# Altium project EV75E52A_R3.PrjPcb (part 1 of 4)
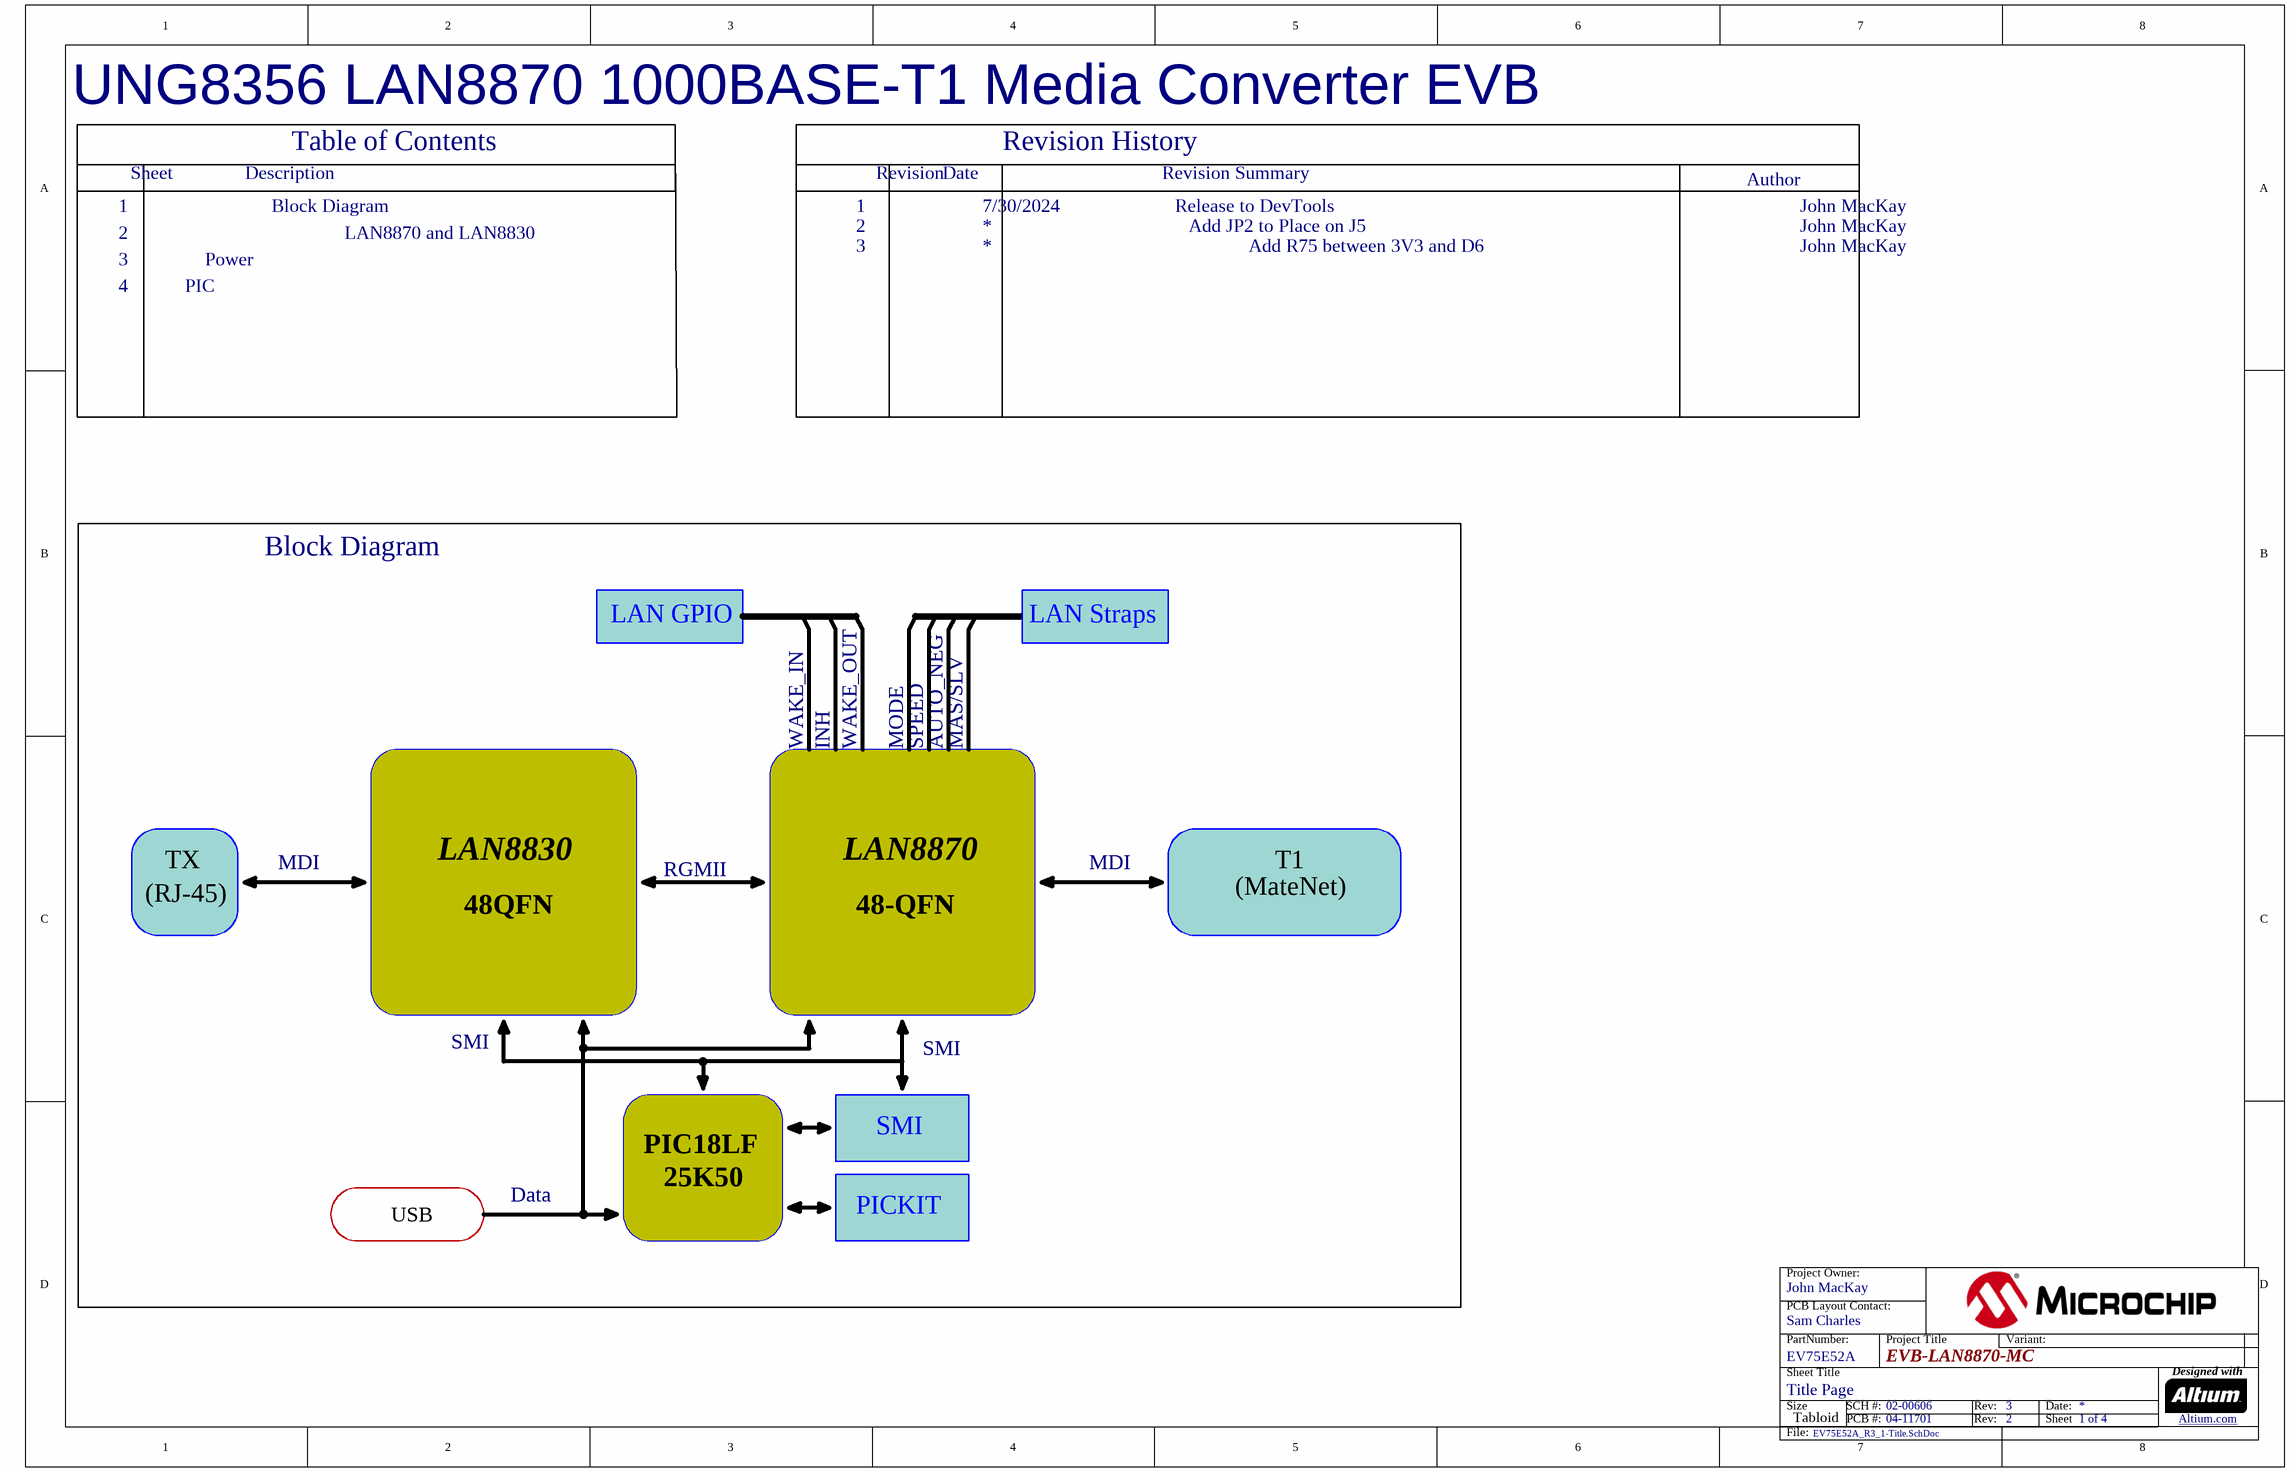
[diagram p0: EV75E52A_R3_1-Title.SchDoc]
SheetTotal: 4; Sheet4Title: PIC; Sheet3Title: Power; Sheet2Title: LAN8870 and LAN8830; Sheet1Title: Block Diagram; ProjectTitle: EVB-LAN8870-MC; ProjectPCBFabRevision: 2; ProjectPCBFabNumber: 04-11701; ProjectPCBAssyRevision: 3; ProjectPCBAssyNumber: 02-00606; ProjectPartNumber: EV75E52A; ProjectContactPCB: Sam Charles; ProjectContactOwner: John MacKay; ProjectBoardNumber: 11701
4 sheets, 207 parts. Net scope: global (net labels, ports and power ports of the same name join across sheets).
Board file: EV75E52A_R2.PcbDoc
Sheets:
  EV75E52A_R3_1-Title.SchDoc
  EV75E52A_R3_2-PHYs.SchDoc
  EV75E52A_R3_3-Power.SchDoc
  EV75E52A_R3_4-PIC_USB.SchDoc

## Sheet EV75E52A_R3_1-Title.SchDoc
size Tabloid; DocumentNumber: 1; SheetNumber: 1; SheetTotal: 4; PageSetup: Record=PageOptions|CenterHorizontal=True|CenterVertical=True|PrintScale=1.02|XCorrection=1.00|YCorrection=1.00|PrintKind=0|BorderSize=5000000|LeftOffset=0|BottomOffset=0|Orientation=2|PaperLength=1000|PaperWidth=1000|Scale=100|PaperSource=15|PrintQuality=600|MediaType=1|DitherType=10|PrintScaleMode=1|PaperKind=11x17|PaperIndex=17; PageTitle: Title Page; SheetTitle: Title Page; DocumentFullPathAndName: //depot_np_hweng_boards/ung_hweng/UNG_8017_EVB-USB5926/; ProjectName: EV75E52A_R3.PrjPcb

### Notes on the sheet
- UNG8356 LAN8870 1000BASE-T1 Media Converter EVB
- Table of Contents
- Revision History
- 1
- Sheet
- Description
- Revision
- Date
- 7/30/2024
- Revision Summary
- Release to DevTools
- Author
- John MacKay
- 2
- 3
- 4
- PIC
- Add JP2 to Place on J5
- Add R75 between 3V3 and D6
- Block Diagram
- LAN GPIO
- LAN Straps
- WAKE_IN
- INH
- WAKE_OUT
- MODE
- SPEED
- AUTO_NEG
- MAS/SLV
- TX
- MDI
- LAN8830
- RGMII
- LAN8870
- T1
- (RJ-45)
- 48QFN
- 48-QFN
- (MateNet)
- SMI
- PIC18LF
- USB
- Data
- 25K50
- PICKIT
- Project Owner:
- PCB Layout Contact:
- PartNumber:
- Project Title
- Variant:
- Sheet Title
- Size
- Tabloid
- SCH #:
- PCB #:
- Rev:
- Date:
- Designed with
- Altium.com <http://go.altium.com/MicrochipLandingPage_Evaluation.html>
- File:

## Sheet EV75E52A_R3_2-PHYs.SchDoc: LAN8870 and KSZ9131
size Tabloid; DocumentNumber: 2; SheetNumber: 2; SheetTotal: 4; PageSetup: Record=PageOptions|CenterHorizontal=True|CenterVertical=True|PrintScale=1.02|XCorrection=1.00|YCorrection=1.00|PrintKind=0|BorderSize=5000000|LeftOffset=0|BottomOffset=0|Orientation=2|PaperLength=1000|PaperWidth=1000|Scale=100|PaperSource=15|PrintQuality=-3|MediaType=1|DitherType=10|PrintScaleMode=1|PaperKind=11 x 17|PaperIndex=119; PageTitle: LAN8870 and LAN8830; PartNumber: LAN8870_MC; SheetTitle: LAN8870 and LAN8830; DocumentFullPathAndName: //depot_np_hweng_boards/ung_hweng/UNG_8017_EVB-USB5926/
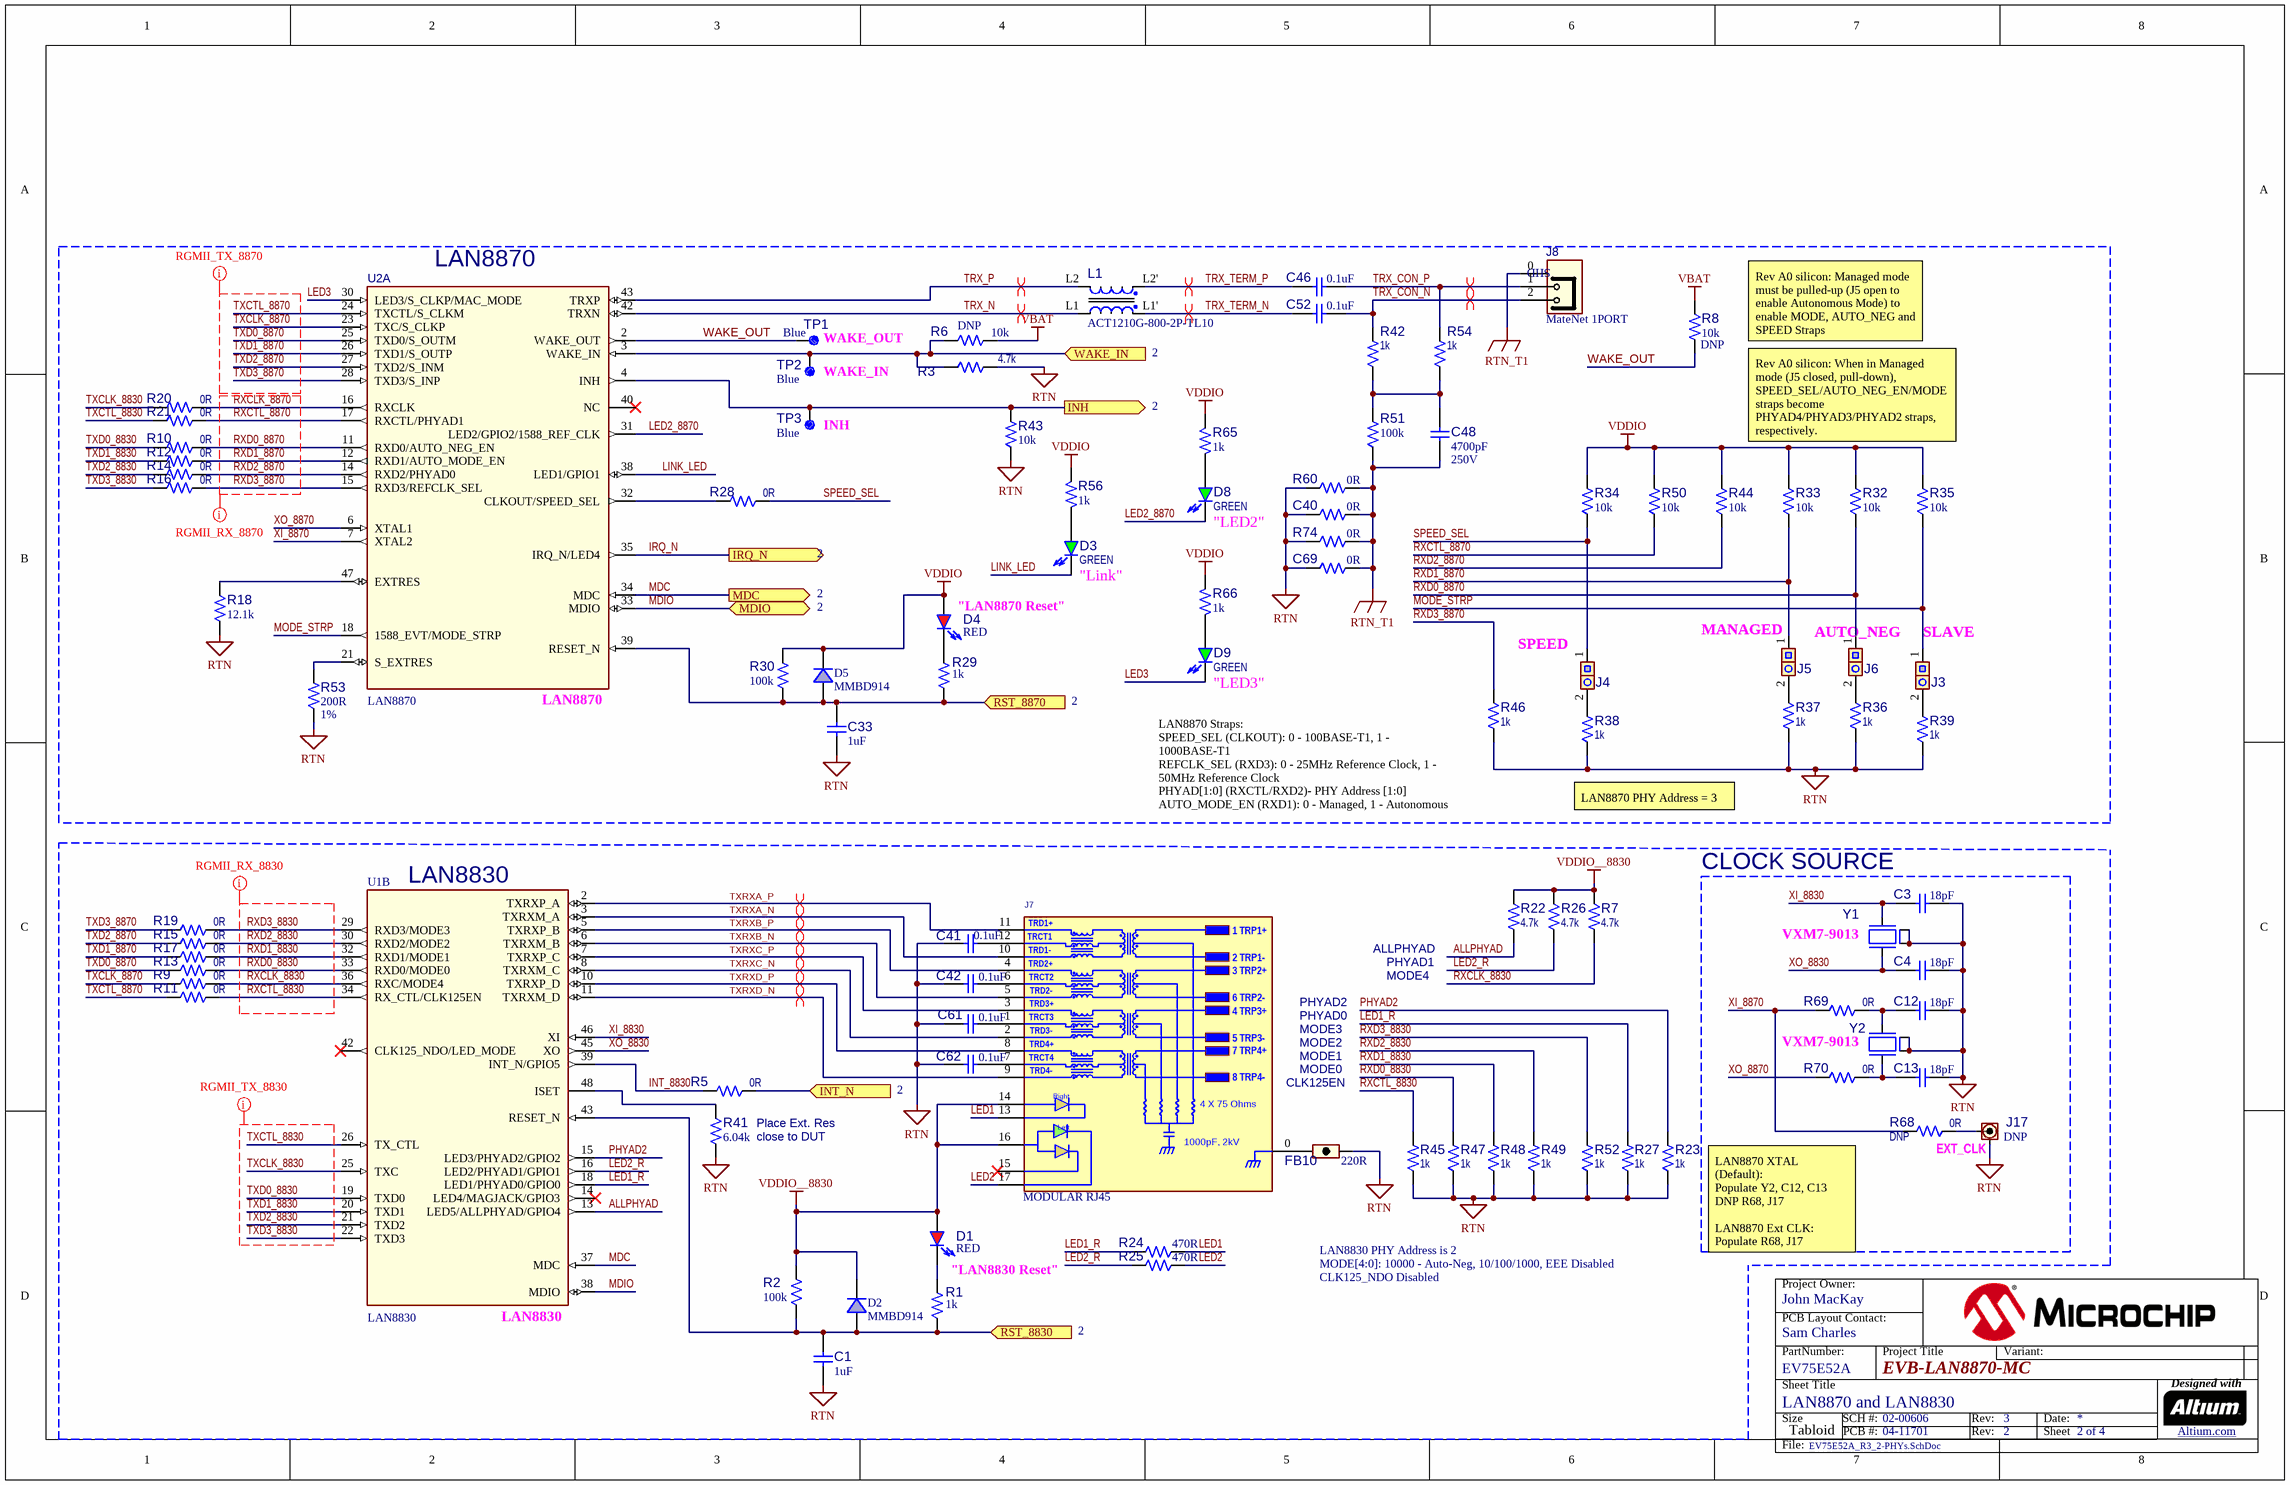
[diagram p1: EV75E52A_R3_2-PHYs.SchDoc]

### Parts
C1  1uF  [CAP_C_0603]
C3  value 18pF  [CAP_C_0402]  (hidden comment: Capacitor NP)
C4  value 18pF  [CAP_C_0402]  (hidden comment: Capacitor NP)
C12  value 18pF  [CAP_C_0402]  (hidden comment: Capacitor NP)
C13  value 18pF  [CAP_C_0402]  (hidden comment: Capacitor NP)
C33  1uF  [CAP_C_0603]
C40  value 0R  [RES_C_0603]  (hidden comment: Resistor)
C41  value 0.1uF  [CAP_C_0402]  (hidden comment: Capacitor NP)
C42  value 0.1uF  [CAP_C_0402]  (hidden comment: Capacitor NP)
C46  value 0.1uF  [CAP_C_0805]  (hidden comment: Capacitor NP)
C48  value 4700pF  Voltage: 250V  [CAP_C_0805]  (hidden comment: Capacitor NP)
C52  value 0.1uF  [CAP_C_0805]  (hidden comment: Capacitor NP)
C61  value 0.1uF  [CAP_C_0402]  (hidden comment: Capacitor NP)
C62  value 0.1uF  [CAP_C_0402]  (hidden comment: Capacitor NP)
C69  value 0R  [RES_C_0603]  (hidden comment: Resistor)
D1  value RED  Legend Note: "LAN8830 Reset"  [LED_0603_RED]  (hidden comment: LED_red)
D2  MMBD914  [SOT-23-3]
D3  value GREEN  Legend Notes: "Link"  [LED_0603_GREEN]  (hidden comment: LED_green)
D4  value RED  Legend Note: "LAN8870 Reset"  [LED_0603_RED]  (hidden comment: LED_red)
D5  MMBD914  [SOT-23-3]
D8  value GREEN  Legend Notes: "LED2"  [LED_0603_GREEN]  (hidden comment: LED_green)
D9  value GREEN  Legend Notes: "LED3"  [LED_0603_GREEN]  (hidden comment: LED_green)
FB10  value 220R  [IND_C_0603]  (hidden comment: Ferrite Bead)
J3  Legend Notes: SLAVE  [HDR_M_2.54_1x2]  (hidden comment: Header 1x2)
J4  Legend Notes: SPEED  [HDR_M_2.54_1x2]  (hidden comment: Header 1x2)
J5  Legend Notes: MANAGED  [HDR_M_2.54_1x2]  (hidden comment: Header 1x2)
J6  Legend Notes: AUTO_NEG  [HDR_M_2.54_1x2]  (hidden comment: Header 1x2)
J7  value MODULAR RJ45  [CON_JACK_RJ45_L829-1J1T-43]  (hidden comment: CON_RJ-45_L829-1J1T-43)
J8  value MateNet 1PORT  [CON_2304372-9]  (hidden comment: 3PIN_WSHD)
J17  Populated: DNP  Legend Note: EXT_CLK  [CON_MMCX_CINCH_135-3701-211]  (hidden comment: RF MMCX Female)
L1  Manufacturer Part Number 1: ACT1210G-800-2P-TL10  [IND_TDK_ACT1210L-201-2P_L3.9W2.5H2.5]  (hidden comment: Inductor Choke)
R1  1k  [RES_C_0603]
R2  100k  [RES_C_0603]
R3  value 4.7k  [RES_C_0402]  (hidden comment: Resistor)
R5  value 0R  [RES_C_0402]  (hidden comment: Resistor)
R6  value 10k  Populated: DNP  [RES_C_0402]  (hidden comment: Resistor)
R7  value 4.7k  [RES_C_0402]  (hidden comment: Resistor)
R8  value 10k  Populated: DNP  [RES_C_0402]  (hidden comment: Resistor)
R9  value 0R  [RES_C_0402]  (hidden comment: Resistor)
R10  value 0R  [RES_C_0402]  (hidden comment: Resistor)
R11  value 0R  [RES_C_0402]  (hidden comment: Resistor)
R12  value 0R  [RES_C_0402]  (hidden comment: Resistor)
R13  value 0R  [RES_C_0402]  (hidden comment: Resistor)
R14  value 0R  [RES_C_0402]  (hidden comment: Resistor)
R15  value 0R  [RES_C_0402]  (hidden comment: Resistor)
R16  value 0R  [RES_C_0402]  (hidden comment: Resistor)
R17  value 0R  [RES_C_0402]  (hidden comment: Resistor)
R18  value 12.1k  [RES_C_0402]  (hidden comment: Resistor)
R19  value 0R  [RES_C_0402]  (hidden comment: Resistor)
R20  value 0R  [RES_C_0402]  (hidden comment: Resistor)
R21  value 0R  [RES_C_0402]  (hidden comment: Resistor)
R22  value 4.7k  [RES_C_0402]  (hidden comment: Resistor)
R23  value 1k  [RES_C_0402]  (hidden comment: Resistor)
R24  value 470R  [RES_C_0402]  (hidden comment: Resistor)
R25  value 470R  [RES_C_0402]  (hidden comment: Resistor)
R26  value 4.7k  [RES_C_0402]  (hidden comment: Resistor)
R27  value 1k  [RES_C_0402]  (hidden comment: Resistor)
R28  value 0R  [RES_C_0402]  (hidden comment: Resistor)
R29  1k  [RES_C_0603]
R30  100k  [RES_C_0603]
R32  value 10k  [RES_C_0402]  (hidden comment: Resistor)
R33  value 10k  [RES_C_0402]  (hidden comment: Resistor)
R34  value 10k  [RES_C_0402]  (hidden comment: Resistor)
R35  value 10k  [RES_C_0402]  (hidden comment: Resistor)
R36  value 1k  [RES_C_0402]  (hidden comment: Resistor)
R37  value 1k  [RES_C_0402]  (hidden comment: Resistor)
R38  value 1k  [RES_C_0402]  (hidden comment: Resistor)
R39  value 1k  [RES_C_0402]  (hidden comment: Resistor)
R41  value 6.04k  [RES_C_0402]  (hidden comment: Resistor)
R42  value 1k  [RES_C_1206]  (hidden comment: Resistor)
R43  value 10k  [RES_C_0402]  (hidden comment: Resistor)
R44  value 10k  [RES_C_0402]  (hidden comment: Resistor)
R45  value 1k  [RES_C_0402]  (hidden comment: Resistor)
R46  value 1k  [RES_C_0402]  (hidden comment: Resistor)
R47  value 1k  [RES_C_0402]  (hidden comment: Resistor)
R48  value 1k  [RES_C_0402]  (hidden comment: Resistor)
R49  value 1k  [RES_C_0402]  (hidden comment: Resistor)
R50  value 10k  [RES_C_0402]  (hidden comment: Resistor)
R51  value 100k  [RES_C_0603]  (hidden comment: Resistor)
R52  value 1k  [RES_C_0402]  (hidden comment: Resistor)
R53  value 200R  Tolerance: 1%  [RES_C_0402]  (hidden comment: Resistor)
R54  value 1k  [RES_C_1206]  (hidden comment: Resistor)
R56  value 1k  [RES_C_0603]  (hidden comment: Resistor)
R60  value 0R  [RES_C_0603]  (hidden comment: Resistor)
R65  value 1k  [RES_C_0603]  (hidden comment: Resistor)
R66  value 1k  [RES_C_0603]  (hidden comment: Resistor)
R68  value 0R  Populated: DNP  [RES_C_0402]  (hidden comment: Resistor)
R69  value 0R  [RES_C_0402]  (hidden comment: Resistor)
R70  value 0R  [RES_C_0402]  (hidden comment: Resistor)
R74  value 0R  [RES_C_0603]  (hidden comment: Resistor)
TP1  value Blue  Legend Note: WAKE_OUT  [CON_TP_TH_V_BLUE_KEC_5117]  (hidden comment: Test Point)
TP2  value Blue  Legend Note: WAKE_IN  [CON_TP_TH_V_BLUE_KEC_5117]  (hidden comment: Test Point)
TP3  value Blue  Legend Note: INH  [CON_TP_TH_V_BLUE_KEC_5117]  (hidden comment: Test Point)
U1  value LAN8830  [QFN-48_7x7_EP5.15x5.15]  (hidden comment: LAN8830 QFN-48)  (part B of 2)
U2  value LAN8870  [QFN-48_7x7_EP5.1x5.1]  (hidden comment: LAN8870 QFN-48)  (part A of 2)
Y1  Legend Note: VXM7-9013  [CRYSTAL_L3.2W2.5H0.8]  (hidden comment: Crystal 4 Pins)
Y2  Crystal 4 Pins  [CRYSTAL_L3.2W2.5H0.8]  (value not drawn)

### Blocks framed on the sheet
LAN8870: C33 C40 C46 C48 C52 C69 D3-D5 D8 D9 J3-J6 J8 L1 R3 R6 R8 R10 R12 R14 R16 R18 R20 R21 R28-R30 R32-R39 R42-R44 R46 R50 R51 R53 R54 R56 R60 R65 R66 R74 TP1-TP3 U2
LAN8830: C1 C41 C42 C61 C62 D1 D2 FB10 J7 R1 R2 R5 R7 R9 R11 R13 R15 R17 R19 R22-R27 R41 R45 R47-R49 R52 U1
CLOCK SOURCE: C3 C4 C12 C13 J17 R68-R70 Y1 Y2

### Ports
INH (out), INT_N (in), IRQ_N (out), MDC (out), MDIO (bidir), RST_8830 (in), RST_8870 (in), WAKE_IN (in)

### Nets
RTN: C1.1 C3.2 C4.2 C12.2 C13.2 C33.1 C40.1 C41.1 C42.1 C61.1 C62.1 C69.1 FB10.2 J17.2 R3.1 R18.1 R23.1 R27.1 R36.1 R37.1 R38.1 R39.1 R41.1 R43.1 R45.1 R46.1 R47.1 R48.1 R49.1 R52.1 R53.1 R60.1 R74.1 Y1.2(GND) Y1.4(GND) Y2.2(GND) Y2.4(GND)
RTN_T1: C40.2 C48.1 C69.2 J8.0 R51.1 R60.2 R74.2
VBAT: R6.1 R8.2
VDDIO: D4.1(A) D5.3(K) R30.2 R32.2 R33.2 R34.2 R35.2 R44.2 R50.2 R56.1 R65.1 R66.1
VDDIO__8830: D1.1(A) D2.3(K) J7.14 J7.16 R2.2 R7.2 R22.2 R26.2
ALLPHYAD: R22.1 U1.13(LED5/ALLPHYAD/GPIO4)
INH: R43.2 TP3.1 U2.4(INH) ; port INH
INT_8830: R5.1 U1.39(INT_N/GPIO5)
INT_N: R5.2 ; port INT_N
IRQ_N: U2.35(IRQ_N/LED4) ; port IRQ_N
LED1: J7.13 R24.2
LED1_R: R24.1 R27.2 U1.18(LED1/PHYAD0/GPIO0)
LED2: J7.17 R25.2
LED2_8870: D8.2(K) U2.31(LED2/GPIO2/1588_REF_CLK)
LED2_R: R25.1 R26.1 U1.16(LED2/PHYAD1/GPIO1)
LED3: D9.2(K) U2.30(LED3/S_CLKP/MAC_MODE)
LINK_LED: D3.2(K) U2.38(LED1/GPIO1)
MDC: U1.37(MDC) U2.34(MDC) ; port MDC
MDIO: U1.38(MDIO) U2.33(MDIO) ; port MDIO
MODE_STRP: J3.1 R35.1 U2.18(1588_EVT/MODE_STRP)
PHYAD2: R23.2 U1.15(LED3/PHYAD2/GPIO2)
RST_8830: C1.2 D2.1(A) R1.2 R2.1 U1.43(RESET_N) ; port RST_8830
RST_8870: C33.2 D5.1(A) R29.2 R30.1 U2.39(RESET_N) ; port RST_8870
RXCLK_8830: R7.1 R9.2 U1.36(RXC/MODE4)
RXCLK_8870: R20.2 U2.16(RXCLK)
RXCTL_8830: R11.2 R45.2 U1.34(RX_CTL/CLK125EN)
RXCTL_8870: R21.2 R50.1 U2.17(RXCTL/PHYAD1)
RXD0_8830: R13.2 R47.2 U1.33(RXD0/MODE0)
RXD0_8870: J6.1 R10.2 R32.1 U2.11(RXD0/AUTO_NEG_EN)
RXD1_8830: R17.2 R48.2 U1.32(RXD1/MODE1)
RXD1_8870: J5.1 R12.2 R33.1 U2.12(RXD1/AUTO_MODE_EN)
RXD2_8830: R15.2 R49.2 U1.30(RXD2/MODE2)
RXD2_8870: R14.2 R44.1 U2.14(RXD2/PHYAD0)
RXD3_8830: R19.2 R52.2 U1.29(RXD3/MODE3)
RXD3_8870: R16.2 R46.2 U2.15(RXD3/REFCLK_SEL)
SPEED_SEL: J4.1 R28.2 R34.1
TRX_CON_N: C52.1 J8.2 R42.2
TRX_CON_P: C46.1 J8.1 R54.2
TRX_N: L1.L1 U2.42(TRXN)
TRX_P: L1.L2 U2.43(TRXP)
TRX_TERM_N: C52.2 L1.L1'
TRX_TERM_P: C46.2 L1.L2'
TXCLK_8830: R20.1 U1.25(TXC)
TXCLK_8870: R9.1 U2.23(TXC/S_CLKP)
TXCTL_8830: R21.1 U1.26(TX_CTL)
TXCTL_8870: R11.1 U2.24(TXCTL/S_CLKM)
TXD0_8830: R10.1 U1.19(TXD0)
TXD0_8870: R13.1 U2.25(TXD0/S_OUTM)
TXD1_8830: R12.1 U1.20(TXD1)
TXD1_8870: R17.1 U2.26(TXD1/S_OUTP)
TXD2_8830: R14.1 U1.21(TXD2)
TXD2_8870: R15.1 U2.27(TXD2/S_INM)
TXD3_8830: R16.1 U1.22(TXD3)
TXD3_8870: R19.1 U2.28(TXD3/S_INP)
TXRXA_N: J7.10 U1.3(TXRXM_A)
TXRXA_P: J7.11 U1.2(TXRXP_A)
TXRXB_N: J7.5 U1.6(TXRXM_B)
TXRXB_P: J7.4 U1.5(TXRXP_B)
TXRXC_N: J7.2 U1.8(TXRXM_C)
TXRXC_P: J7.3 U1.7(TXRXP_C)
TXRXD_N: J7.9 U1.11(TXRXM_D)
TXRXD_P: J7.8 U1.10(TXRXP_D)
WAKE_IN: R3.2 R6.2 TP2.1 U2.3(WAKE_IN) ; port WAKE_IN
WAKE_OUT: R8.1 TP1.1 U2.2(WAKE_OUT)
XI_8830: C3.1 U1.46(XI) Y1.3(Osc2)
XI_8870: R68.1 R69.1 U2.7(XTAL2)
XO_8830: C4.1 U1.45(XO) Y1.1(Osc1)
XO_8870: R70.1 U2.6(XTAL1)
NetC12_1: C12.1 R69.2 Y2.3(Osc2)
NetC13_1: C13.1 R70.2 Y2.1(Osc1)
NetC41_2: C41.2 J7.12
NetC42_2: C42.2 J7.6
NetC48_2: C48.2 R42.1 R51.2 R54.1
NetC61_2: C61.2 J7.1
NetC62_2: C62.2 J7.7
NetD1_2: D1.2(K) R1.1
NetD3_1: D3.1(A) R56.2
NetD4_2: D4.2(K) R29.1
NetD8_1: D8.1(A) R65.2
NetD9_1: D9.1(A) R66.2
NetFB10_1: FB10.1 J7.0(SHLD)
NetJ3_2: J3.2 R39.2
NetJ4_2: J4.2 R38.2
NetJ5_2: J5.2 R37.2
NetJ6_2: J6.2 R36.2
NetJ17_1: J17.1 R68.2
NetR18_2: R18.2 U2.47(EXTRES)
NetR28_1: R28.1 U2.32(CLKOUT/SPEED_SEL)
NetR41_2: R41.2 U1.48(ISET)
NetR53_2: R53.2 U2.21(S_EXTRES)

Not connected (* = marked no-connect by the designer): J7 15*; U1 14(LED4/MAGJACK/GPIO3)* 42(CLK125_NDO/LED_MODE)*; U2 40(NC)*

### Layout directives
net class RGMII_TX_8870; rule Matched Net Lengths [Tolerance = 50mil]: TXCLK_8870, TXCTL_8870, TXD0_8870, TXD1_8870, TXD2_8870, TXD3_8870
net class RGMII_RX_8870; rule Matched Net Lengths [Tolerance = 50mil]: RXCLK_8870, RXCTL_8870, RXD0_8870, RXD1_8870, RXD2_8870, RXD3_8870
net class RGMII_TX_8830; rule Matched Net Lengths [Tolerance = 50mil]: TXCLK_8830, TXCTL_8830, TXD0_8830, TXD1_8830, TXD2_8830, TXD3_8830
net class RGMII_RX_8830; rule Matched Net Lengths [Tolerance = 50mil]: RXCLK_8830, RXCTL_8830, RXD0_8830, RXD1_8830, RXD2_8830, RXD3_8830
differential pair; differential pair class 100R; rule Matched Net Lengths [Tolerance = 50mil]; rule Matched Net Lengths [Tolerance = 50mil]: TRX_N, TRX_P, TXRXA_N, TXRXA_P, TXRXB_N, TXRXB_P, TXRXC_N, TXRXC_P, TXRXD_N, TXRXD_P
differential pair; net class 100Rnoplane: TRX_CON_N, TRX_CON_P, TRX_TERM_N, TRX_TERM_P

### Notes on the sheet
- Rev A0 silicon: Managed mode must be pulled-up (J5 open to enable Autonomous Mode) to enable MODE, AUTO_NEG and SPEED Straps
- Rev A0 silicon: When in Managed mode (J5 closed, pull-down), SPEED_SEL/AUTO_NEG_EN/MODE straps become PHYAD4/PHYAD3/PHYAD2 straps, respectively.
- (near R46) LAN8870 Straps:
  SPEED_SEL (CLKOUT): 0 - 100BASE-T1, 1 - 1000BASE-T1
  REFCLK_SEL (RXD3): 0 - 25MHz Reference Clock, 1 - 50MHz Reference Clock
  PHYAD[1:0] (RXCTL/RXD2)- PHY Address [1:0]
  AUTO_MODE_EN (RXD1): 0 - Managed, 1 - Autonomous
  AUTO_NEG_EN (RXD0): 0 - Auto-Negotiation Disabled, 1 - Auto-Negotiation Enabled
  MODE_STRP (RXER): 0 - Client, 1 - Host
- (near R38) LAN8870 PHY Address = 3
- ALLPHYAD
- PHYAD1
- (near J7) PHYAD0
- (near J7) PHYAD2
- (near J7) MODE3
- MODE4
- (near J7) CLK125EN
- (near J7) MODE2
- (near J7) MODE0
- (near J7) MODE1
- VXM7-9013
- Place Ext. Res
- close to DUT
- LAN8830 PHY Address is 2
- MODE[4:0]: 10000 - Auto-Neg, 10/100/1000, EEE Disabled
- CLK125_NDO Disabled
- LAN8870 XTAL (Default):
  Populate Y2, C12, C13
  DNP R68, J17
  LAN8870 Ext CLK:
  Populate R68, J17
  DNP Y2, C12, C13
- Project Owner:
- PCB Layout Contact:
- PartNumber:
- Project Title
- Variant:
- Sheet Title
- Size
- Tabloid
- SCH #:
- PCB #:
- Rev:
- Date:
- Sheet
- Designed with
- Altium.com <http://go.altium.com/MicrochipLandingPage_Evaluation.html>
- File:
- (in symbol CON2446) SHD
- (in symbol CON2551) 1 TRP1+; TRD1+; TRCT1; 2 TRP1-; TRD1-; 3 TRP2+; TRD2+; TRCT2; 6 TRP2-; TRD2-; 4 TRP3+; TRD3+; TRCT3; 5 TRP3-; TRD3-; TRD4+; 7 TRP4+; TRCT4; TRD4-; 8 TRP4-; Right; 4 X 75 Ohms; Left; 1000pF, 2kV